# Altium project Design_board.PrjPcb
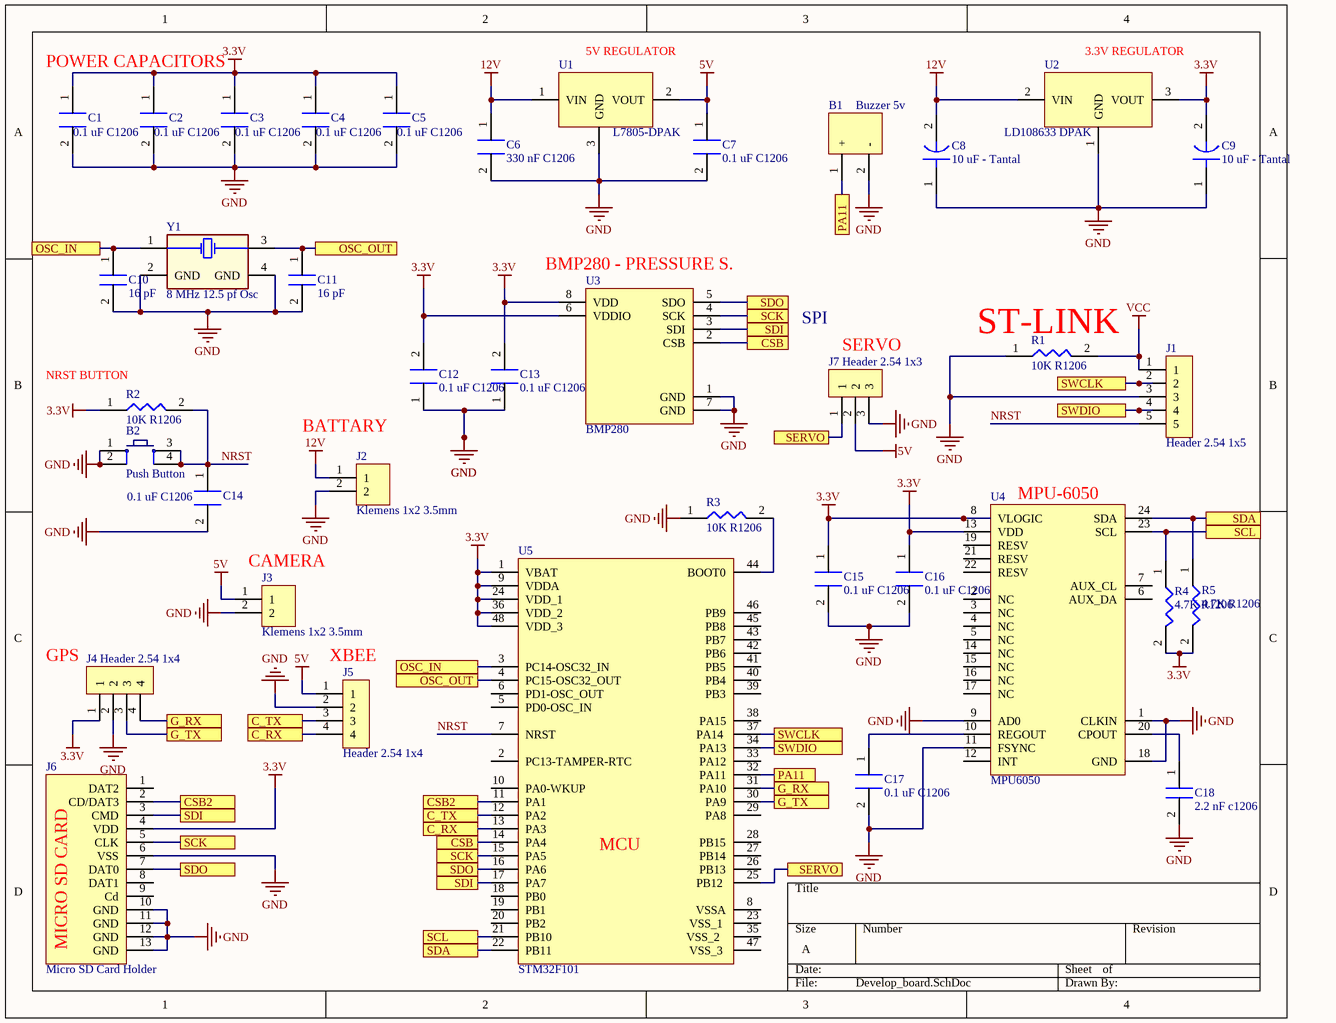
[diagram p0: Develop_board.SchDoc]
1 sheet, 38 parts. Net scope: flat (ports and power ports of the same name join across sheets).
Board file: Develop_board.PcbDoc

## Sheet Develop_board.SchDoc
size A; SheetNumber: 1; SheetTotal: 1

### Parts
B1  Buzzer 5v  [Buzzer 5v]
B2  Push Button  [PUSB BUTTON-SMD]
C1  0.1 uF C1206  [C1206]
C2  0.1 uF C1206  [C1206]
C3  0.1 uF C1206  [C1206]
C4  0.1 uF C1206  [C1206]
C5  0.1 uF C1206  [C1206]
C6  330 nF C1206  [C1206]
C7  0.1 uF C1206  [C1206]
C8  10 uF - Tantal  [C1206- TANTAL]
C9  10 uF - Tantal  [C1206- TANTAL]
C10  16 pF  [C1206]
C11  16 pF  [C1206]
C12  0.1 uF C1206  [C1206]
C13  0.1 uF C1206  [C1206]
C14  0.1 uF C1206  [C1206]
C15  0.1 uF C1206  [C1206]
C16  0.1 uF C1206  [C1206]
C17  0.1 uF C1206  [C1206]
C18  2.2 nF c1206  [C1206]
J1  Header 2.54 1x5  [Header 2.54 1x5]
J2  Klemens 1x2 3.5mm  [Klemens 1x2 - 3.5mm]
J3  Klemens 1x2 3.5mm  [Klemens 1x2 - 3.5mm]
J4  Header 2.54 1x4  [Header 2.54 1x4]
J5  Header 2.54 1x4  [Header 2.54 1x4]
J6  Micro SD Card Holder  [Micro SD Card Holder]
J7  Header 2.54 1x3  [Header 2.54 1x3]
R1  10K R1206  [R1206 Resistor]
R2  10K R1206  [R1206 Resistor]
R3  10K R1206  [R1206 Resistor]
R4  4.7K R1206  [R1206 Resistor]
R5  4.7K R1206  [R1206 Resistor]
U1  L7805-DPAK  [DPAK228P972X230-3N]
U2  LD108633 DPAK  [DPAK228P972X230-3N]
U3  BMP280  [BMP280]
U4  MPU6050  [QFN50P400X400X90_HS-25N]
U5  STM32F101  [LQFP48-STM]
Y1  8 MHz 12.5 pf Osc  [8 MHZ Osc.]

### Ports
C_RX, C_TX, CSB, CSB2, G_RX, G_TX, OSC_IN, OSC_OUT, PA11, SCK, SCL, SDA, SDI, SDO, SERVO, SWCLK, SWDIO

### Nets
3.3V: C1.1 C2.1 C3.1 C4.1 C5.1 C9.2 C12.2 C13.2 C15.1 C16.1 J4.1 J6.4(VDD) R2.1 R4.2 R5.2 U2.3(VOUT) U3.6(VDDIO) U3.8(VDD) U4.8(VLOGIC) U4.13(VDD) U5.1(VBAT) U5.9(VDDA) U5.24(VDD_1) U5.36(VDD_2) U5.48(VDD_3)
5V: C7.1 J3.1 J5.1 J7.2 U1.2(VOUT)
12V: C6.1 C8.2 J2.1 U1.1(VIN) U2.2(VIN)
GND: B1.2(-) B2.1 B2.2 C1.2 C2.2 C3.2 C4.2 C5.2 C6.2 C7.2 C8.1 C9.1 C10.2 C11.2 C12.1 C13.1 C14.2 C15.2 C16.2 C17.2 C18.2 J1.3 J2.2 J3.2 J4.2 J5.2 J6.6(VSS) J6.10(GND) J6.11(GND) J6.12(GND) J6.13(GND) J7.3 R1.1 R3.1 U1.3(GND) U2.1(GND) U3.1(GND) U3.7(GND) U4.1(CLKIN) U4.9(AD0) U4.11(FSYNC) U4.18(GND) Y1.2(GND) Y1.4(GND)
VCC: J1.1 R1.2
NRST: B2.3 B2.4 C14.1 J1.5 R2.2 U5.7(NRST)
NetB1_1: B1.1(+) U5.32(PA11) ; port PA11
NetC10_1: C10.1 U5.3(PC14-OSC32_IN) Y1.1 ; port OSC_IN
NetC11_1: C11.1 U5.4(PC15-OSC32_OUT) Y1.3 ; port OSC_OUT
NetC17_1: C17.1 U4.10(REGOUT)
NetC18_1: C18.1 U4.20(CPOUT)
NetJ1_2: J1.2 U5.37(PA14) ; port SWCLK
NetJ1_4: J1.4 U5.34(PA13) ; port SWDIO
NetJ4_3: J4.3 U5.30(PA9) ; port G_TX
NetJ4_4: J4.4 U5.31(PA10) ; port G_RX
NetJ5_3: J5.3 U5.12(PA2) ; port C_TX
NetJ5_4: J5.4 U5.13(PA3) ; port C_RX
NetJ6_2: J6.2(CD/DAT3) U5.11(PA1) ; port CSB2
NetJ6_3: J6.3(CMD) U3.3(SDI) U5.17(PA7) ; port SDI
NetJ6_5: J6.5(CLK) U3.4(SCK) U5.15(PA5) ; port SCK
NetJ6_7: J6.7(DAT0) U3.5(SDO) U5.16(PA6) ; port SDO
NetJ7_1: J7.1 U5.25(PB12) ; port SERVO
NetR3_2: R3.2 U5.44(BOOT0)
NetR4_1: R4.1 U4.23(SCL) U5.21(PB10) ; port SCL
NetR5_1: R5.1 U4.24(SDA) U5.22(PB11) ; port SDA
NetU3_2: U3.2(CSB) U5.14(PA4) ; port CSB

Not connected (* = marked no-connect by the designer): J6 1(DAT2) 8(DAT1) 9(Cd); U4 2(NC) 3(NC) 4(NC) 5(NC) 6(AUX_DA) 7(AUX_CL) 12(INT) 14(NC) 15(NC) 16(NC) 17(NC) 19(RESV) 21(RESV) 22(RESV); U5 2(PC13-TAMPER-RTC) 5(PD0-OSC_IN) 6(PD1-OSC_OUT) 8(VSSA) 10(PA0-WKUP) 18(PB0) 19(PB1) 20(PB2) 23(VSS_1_) 26(PB13) 27(PB14) 28(PB15) 29(PA8) 33(PA12) 35(VSS_2__) 38(PA15) 39(PB3) 40(PB4) 41(PB5) 42(PB6) 43(PB7) 45(PB8) 46(PB9) 47(VSS_3_)

### Notes on the sheet
- POWER CAPACITORS
- (near U1) 5V REGULATOR
- (near U2) 3.3V REGULATOR
- (near U3) BMP280 - PRESSURE S.
- SPI
- (near J7) SERVO
- (near R1) ST-LINK
- (near R2) NRST BUTTON
- (near J2) BATTARY
- (near U4) MPU-6050
- (near J3) CAMERA
- (near J4) GPS
- (near J5) XBEE
- (near U5) MCU
- MICRO SD CARD

### Library data of the parts
B2 = Push Button: Smd Push Button; Satın Alma Linki: https://urun.n11.com/diger/mini-pushbutton-switch-smd-P227461537?gclid=Cj0KCQjwkoDmBRCcARIsAG3xzl8Y_-jeD7HocNM6lvuZ_rVp83568XPGtNzlPwXWLph8oCRqo0yh87UaApZYEALw_wcB&gclsrc=aw.ds
R1 = 4.7K R1206
U1 = L7805-DPAK: L7805 5V REGULATOR. SMD PAKET
U2 = LD108633 DPAK: LD1086 3.3V REGULATOR
U3 = BMP280: BMP280 SENSOR
U4 = MPU6050: MPU6050 GYRO SENSOR
U5 = STM32F101: STM32F101 48 PİNLİ MİKROİŞLEMCİ